# EAGLE design md_ver10.6 (EAGLE 6.4)
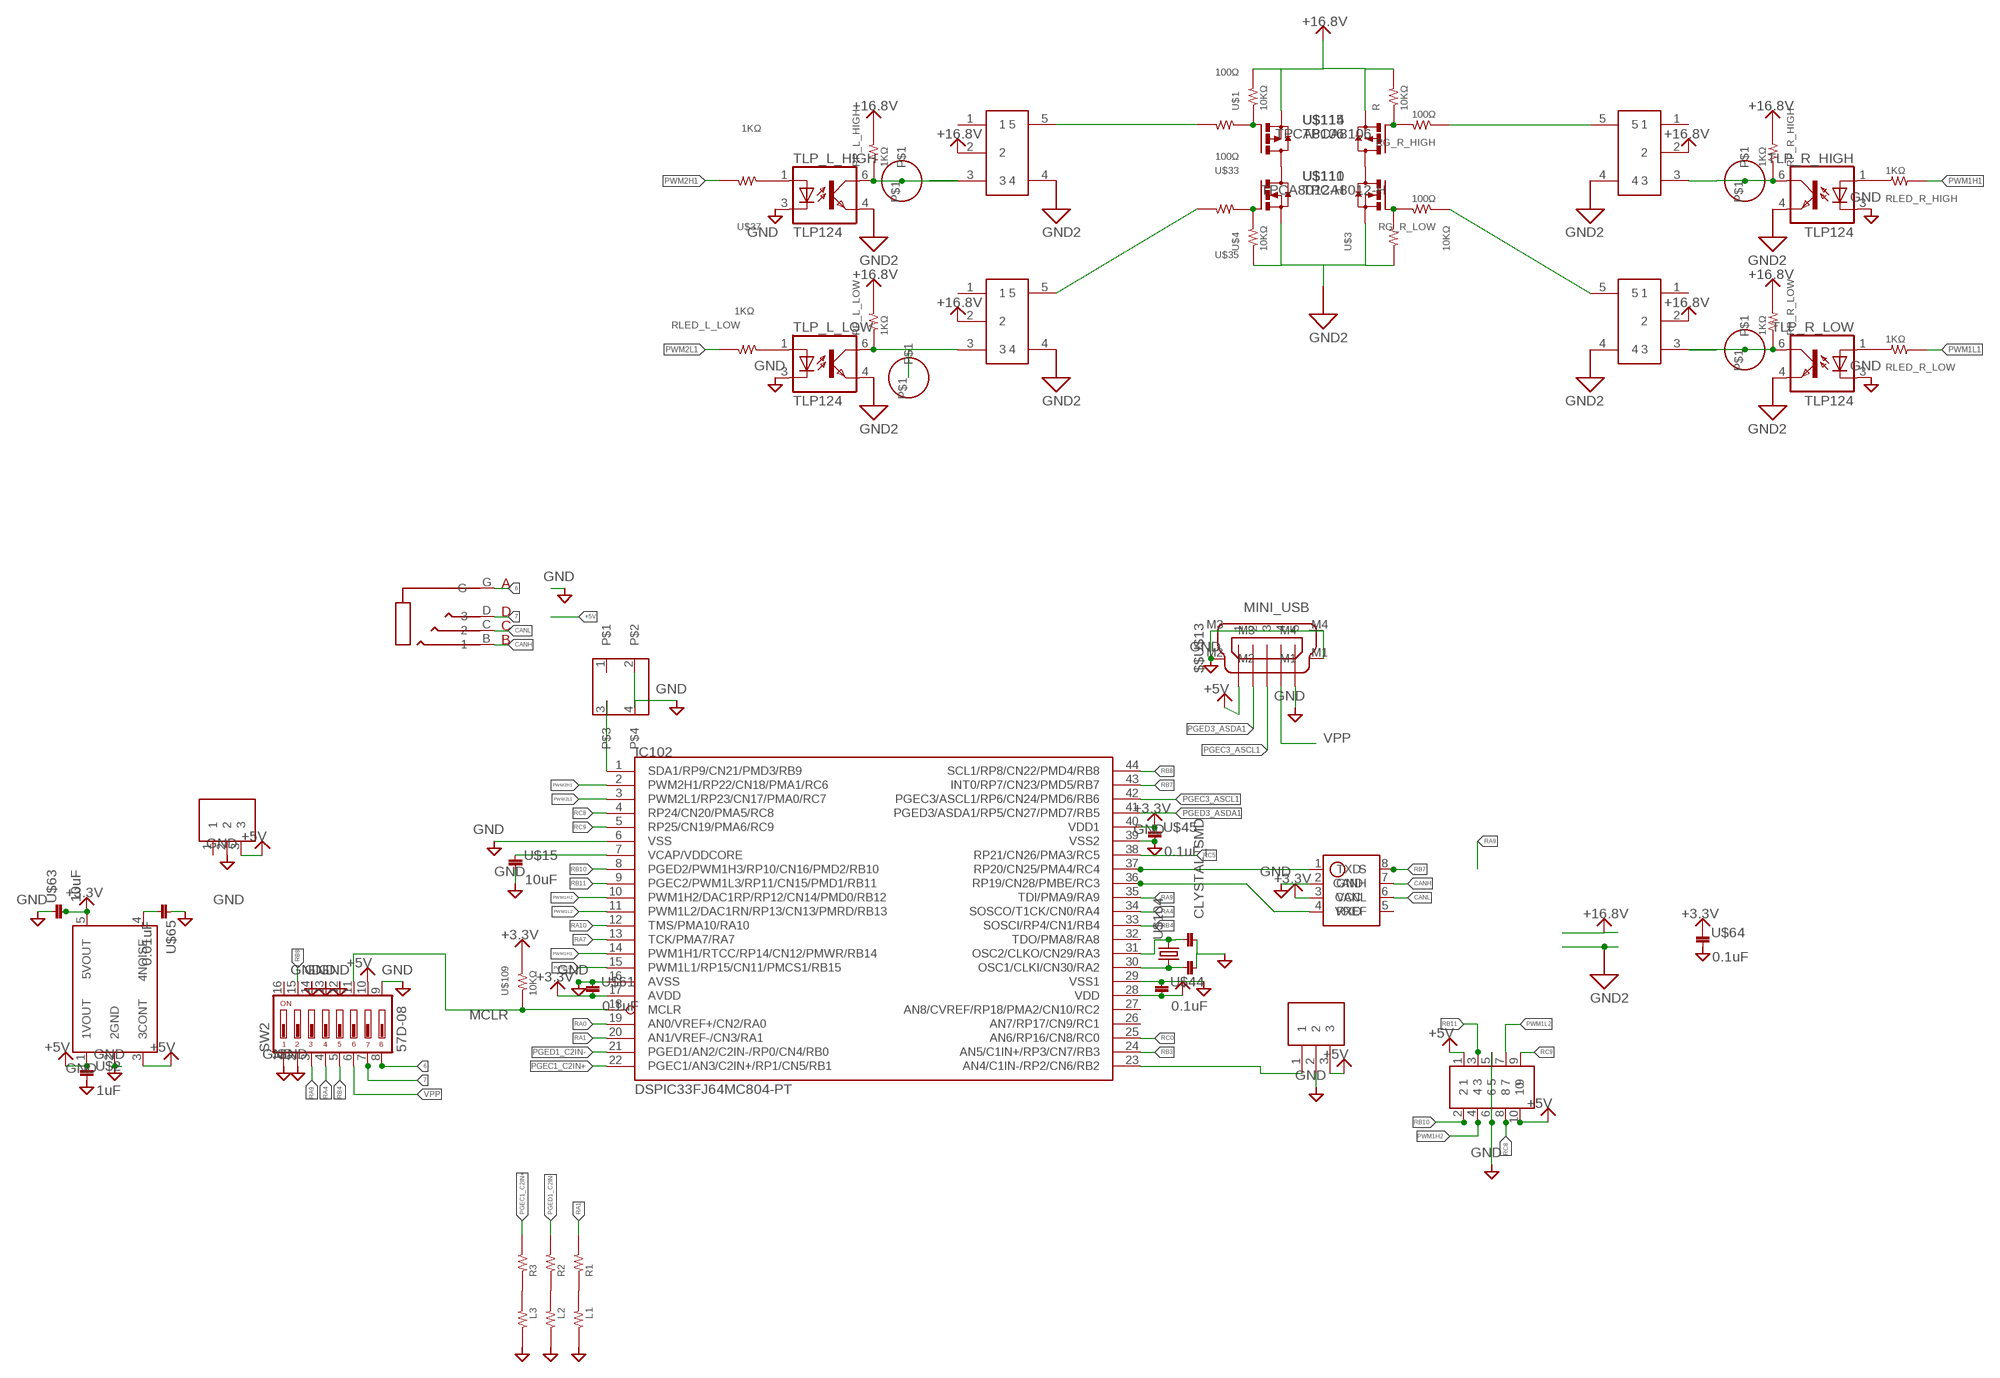
[diagram p0: schematic, sheet 1]

## Parts
$$U$5  PAD1_4MM  [PAD1_4MM]
$$U$6  PAD1_4MM  [PAD1_4MM]
$$U$13  MINI_USB  [MINI_USB]
$$U$14  AUDIO4  [AUDIO4_MJ]
$$U$102  20pF  1608  [1608]
$$U$108  R1  RESISTOR__SMD  [1608]
IC1  Ｒ－７８Ｅ５．０  [Ｒ－７８Ｅ５．０]
IC2  ＰＬ－ＩＲＭ  [ＰＬ－ＩＲＭ]
IC100  SN65HVD1050  [SOIC8]
IC101  TAR5SB  [SSOP5-P-0.95]
IC102  DSPIC33FJ64MC804-PT  [TQFP44]
IC_L_HIGH  MCP1415  [SOT23-5L]
IC_L_LOW  MCP1415  [SOT23-5L]
IC_R_HIGH  MCP1415  [SOT23-5L]
IC_R_LOW  MCP1415  [SOT23-5L]
R  10KΩ  RESISTOR__SMD  [1608]
RG_R_HIGH  100Ω  RESISTOR__SMD  [1608]
RG_R_LOW  100Ω  RESISTOR__SMD  [1608]
RLED_L_LOW  1KΩ  RESISTOR__SMD  [1608]
RLED_R_HIGH  1KΩ  RESISTOR__SMD  [1608]
RLED_R_LOW  1KΩ  RESISTOR__SMD  [1608]
RP_L_HIGH  1KΩ  RESISTOR__SMD  [1608]
RP_L_LOW  1KΩ  RESISTOR__SMD  [1608]
RP_R_HIGH  1KΩ  RESISTOR__SMD  [1608]
RP_R_LOW  1KΩ  RESISTOR__SMD  [1608]
SW1  TACT  [TL1105]
SW2  57D-08  [57D]
TLP_L_HIGH  TLP124  [11−4C1]
TLP_L_LOW  TLP124  [11−4C1]
TLP_R_HIGH  TLP124  [11−4C1]
TLP_R_LOW  TLP124  [11−4C1]
U$1  10KΩ  RESISTOR__SMD  [1608]
U$2  1uF  1608  [1608]
U$3  10KΩ  RESISTOR__SMD  [1608]
U$4  10KΩ  RESISTOR__SMD  [1608]
U$7  PAD1_4MM  [PAD1_4MM]
U$8  PAD1_4MM  [PAD1_4MM]
U$9  PIN_HEADER_52  [PIN_HEADER_5*2]
U$10  L1  RESISTOR__SMD  [1608]
U$11  L2  RESISTOR__SMD  [1608]
U$12  L3  RESISTOR__SMD  [1608]
U$15  10uF  2012  [2012]
U$33  100Ω  RESISTOR__SMD  [1608]
U$35  100Ω  RESISTOR__SMD  [1608]
U$37  1KΩ  RESISTOR__SMD  [1608]
U$44  0.1uF  1608  [1608]
U$45  0.1uF  1608  [1608]
U$61  0.1uF  1608  [1608]
U$63  10uF  2012  [2012]
U$64  0.1uF  1608  [1608]
U$65  0.01uF  1608  [1608]
U$103  20pF  1608  [1608]
U$104  CLYSTAL_SMD  [CRYSTAL_SMD]
U$106  R3  RESISTOR__SMD  [1608]
U$107  R2  RESISTOR__SMD  [1608]
U$109  10KΩ  RESISTOR__SMD  [1608]
U$110  TPCA8012-H  [2-5Q1A]
U$111  TPCA8012-H  [2-5Q1A]
U$114  TPCA8106  [2-5Q1A]
U$115  TPCA8106  [2-5Q1A]

## Nets
6: $$U$14.G SW2.8
7: $$U$14.D SW2.7
+3.3V: IC100.3(VCC) IC101.5(5VOUT) IC102.17(AVDD) IC102.28(VDD) IC102.40(VDD1) U$44.P$2 U$45.P$1 U$61.P$2 U$63.2 U$64.P$1 U$109.2
+5V: $$U$13.1 IC1.3 IC2.3 IC101.1(1VOUT) IC101.3(3CONT) SW2.10 U$2.P$1 U$9.1 U$9.10
+16.8V: IC_L_HIGH.2 IC_L_LOW.2 IC_R_HIGH.2 IC_R_LOW.2 R.2 RP_L_HIGH.2 RP_L_LOW.2 RP_R_HIGH.2 RP_R_LOW.2 U$1.2 U$114.1(S) U$114.2(S) U$114.3(S) U$115.1(S) U$115.2(S) U$115.3(S)
CANH: $$U$14.B IC100.7(CANH)
CANL: $$U$14.C IC100.6(CANL)
GND: $$U$13.5 $$U$13.M1 $$U$13.M2 $$U$13.M3 $$U$13.M4 $$U$102.P$2 IC1.2 IC2.2 IC100.2(GND) IC101.2(2GND) IC102.6(VSS) IC102.16(AVSS) IC102.29(VSS1) IC102.39(VSS2) SW1.2 SW1.4 SW2.1 SW2.2 SW2.9 SW2.12 SW2.13 SW2.14 TLP_L_HIGH.3(C) TLP_L_LOW.3(C) TLP_R_HIGH.3(C) TLP_R_LOW.3(C) U$2.P$2 U$9.5 U$9.6 U$10.1 U$11.1 U$12.1 U$15.2 U$44.P$1 U$45.P$2 U$61.P$1 U$63.1 U$64.P$2 U$65.P$1 U$103.P$2
GND2: IC_L_HIGH.4 IC_L_LOW.4 IC_R_HIGH.4 IC_R_LOW.4 TLP_L_HIGH.4(EMIT) TLP_L_LOW.4(EMIT) TLP_R_HIGH.4(EMIT) TLP_R_LOW.4(EMIT) U$3.1 U$4.1 U$110.1(S) U$110.2(S) U$110.3(S) U$111.1(S) U$111.2(S) U$111.3(S)
M1: U$111.5(D) U$111.6(D) U$111.7(D) U$111.8(D) U$115.5(D) U$115.6(D) U$115.7(D) U$115.8(D)
M2: U$110.5(D) U$110.6(D) U$110.7(D) U$110.8(D) U$114.5(D) U$114.6(D) U$114.7(D) U$114.8(D)
MCLR: IC102.18(MCLR) SW2.11 U$109.1
N$1: U$4.2 U$35.1 U$111.4(G)
N$2: IC101.4(4NOISE) U$65.P$2
N$3: RLED_L_LOW.1 TLP_L_LOW.1(A)
N$4: RG_R_LOW.2 U$3.2 U$110.4(G)
N$5: IC_L_HIGH.5 U$33.2
N$6: $$U$6.P$1 IC_L_LOW.3 RP_L_LOW.1 TLP_L_LOW.6(COL)
N$7: IC_R_LOW.5 RG_R_LOW.1
N$9: RLED_R_LOW.1 TLP_R_LOW.1(A)
N$10: TLP_L_HIGH.1(A) U$37.1
N$11: $$U$5.P$1 IC_L_HIGH.3 RP_L_HIGH.1 TLP_L_HIGH.6(COL)
N$14: IC_L_LOW.5 U$35.2
N$15: IC_R_HIGH.3 RP_R_HIGH.1 TLP_R_HIGH.6(COL) U$8.P$1
N$16: RLED_R_HIGH.1 TLP_R_HIGH.1(A)
N$17: IC2.1 IC102.23(AN4/C1IN-/RP2/CN6/RB2)
N$18: IC_R_HIGH.5 RG_R_HIGH.1
N$19: U$1.1 U$33.1 U$115.4(G)
N$20: R.1 RG_R_HIGH.2 U$114.4(G)
N$21: U$12.2 U$106.1
N$22: $$U$102.P$1 IC102.30(OSC1/CLKI/CN30/RA2) U$104.1
N$23: IC102.31(OSC2/CLKO/CN29/RA3) U$103.P$1 U$104.2
N$24: U$11.2 U$107.1
N$25: $$U$108.1 U$10.2
N$26: IC102.1(SDA1/RP9/CN21/PMD3/RB9) SW1.3
N$27: IC100.1(TXD) IC102.37(RP20/CN25/PMA4/RC4)
N$30: IC100.4(RXD) IC102.36(RP19/CN28/PMBE/RC3)
PGEC1_C2IN+: IC102.22(PGEC1/AN3/C2IN+/RP1/CN5/RB1) U$106.2
PGEC3_ASCL1: $$U$13.3 IC102.42(PGEC3/ASCL1/RP6/CN24/PMD6/RB6)
PGED1_C2IN-: IC102.21(PGED1/AN2/C2IN-/RP0/CN4/RB0) U$107.2
PGED3_ASDA1: $$U$13.2 IC102.41(PGED3/ASDA1/RP5/CN27/PMD7/RB5)
PWM1H1: IC102.14(PWM1H1/RTCC/RP14/CN12/PMWR/RB14) RLED_R_HIGH.2
PWM1H2: IC102.10(PWM1H2/DAC1RP/RP12/CN14/PMD0/RB12) U$9.4
PWM1L1: IC102.15(PWM1L1/RP15/CN11/PMCS1/RB15) RLED_R_LOW.2
PWM1L2: IC102.11(PWM1L2/DAC1RN/RP13/CN13/PMRD/RB13) U$9.7
PWM2H1: IC102.2(PWM2H1/RP22/CN18/PMA1/RC6) U$37.2
PWM2L1: IC102.3(PWM2L1/RP23/CN17/PMA0/RC7) RLED_L_LOW.2
RA0: IC102.19(AN0/VREF+/CN2/RA0)
RA1: $$U$108.2 IC102.20(AN1/VREF-/CN3/RA1)
RA4: IC102.34(SOSCO/T1CK/CN0/RA4) SW2.4
RA7: IC102.13(TCK/PMA7/RA7)
RA9: IC102.35(TDI/PMA9/RA9) SW2.3
RA10: IC102.12(TMS/PMA10/RA10)
RB3: IC102.24(AN5/C1IN+/RP3/CN7/RB3)
RB4: IC102.33(SOSCI/RP4/CN1/RB4) SW2.5
RB7: IC100.8(S) IC102.43(INT0/RP7/CN23/PMD5/RB7)
RB8: IC102.44(SCL1/RP8/CN22/PMD4/RB8) SW2.15
RB10: IC102.8(PGED2/PWM1H3/RP10/CN16/PMD2/RB10) U$9.2
RB11: IC102.9(PGEC2/PWM1L3/RP11/CN15/PMD1/RB11) U$9.3
RC0: IC102.25(AN6/RP16/CN8/RC0)
RC5: IC102.38(RP21/CN26/PMA3/RC5)
RC8: IC102.4(RP24/CN20/PMA5/RC8) U$9.8
RC9: IC102.5(RP25/CN19/PMA6/RC9) U$9.9
TLP_R_LOW: IC_R_LOW.3 RP_R_LOW.1 TLP_R_LOW.6(COL) U$7.P$1
VCAP/VDDCORE: IC102.7(VCAP/VDDCORE) U$15.1
VPP: $$U$13.4 SW2.6
Unconnected: IC1.1 IC100.5(VREF) IC102.26(AN7/RP17/CN9/RC1) IC102.27(AN8/CVREF/RP18/PMA2/CN10/RC2) IC102.32(TDO/PMA8/RA8) IC_L_HIGH.1 IC_L_LOW.1 IC_R_HIGH.1 IC_R_LOW.1 SW1.1 SW2.16

## Library data of the parts
$$U$5 $$U$6 U$7 U$8 = 08_CONECTOR:PAD1_4MM
$$U$13 = 08_CONECTOR:MINI_USB
$$U$14 = 08_CONECTOR:AUDIO4
$$U$102 U$2 U$44 U$45 U$61 U$64 U$65 U$103 = 02_C:1608
$$U$108 R RG_R_HIGH RG_R_LOW RLED_L_LOW RLED_R_HIGH RLED_R_LOW RP_L_HIGH RP_L_LOW RP_R_HIGH RP_R_LOW U$1 U$3 U$4 U$10-U$12 U$33 U$35 U$37 U$106 U$107 U$109 = 01_R:RESISTOR__SMD
IC1 = 04_IC:Ｒ－７８Ｅ５．０
IC2 = 04_IC:ＰＬ－ＩＲＭ
IC100 = 04_IC:SN65HVD1050
IC101 = 04_IC:TAR5SB
IC102 = microchip-dspic33fjxxmc:DSPIC33FJ64MC804: dsPIC33FJ32MC302/304, dsPIC33FJ64MCX02/X04, AND dsPIC33FJ128MCX02/X04 High-Performance, 16-bit Digital Signal Controllers Package:44 Pin TQFP Operating Range: * Up to 40 MIPS operation (at 3.0V -3.6V): - Industrial temperature range (-40°C to +85°C) - Extended temperature range (-40°C to +125°C) High-Performance DSC CPU: * Modified Harvard architecture * C compiler optimized instruction set * 16-bit wide data path * 24-bit wide instructions * Linear program memory addressing up to 4M instruction words * Linear data memory addressing up to 64 Kbytes * 83 base instructions: mostly 1 word/1 cycle * Two 40-bit accumulators with rounding and saturation options * Flexible and powerful addressing modes: - Indirect - Modulo - Bit-Reversed * Software stack * 16 x 16 fractional/integer multiply operations * 32/16 and 16/16 divide operations * Single-cycle multiply and accumulate: - Accumulator write back for DSP operations - Dual data fetch * Up to ±16-bit shifts for up to 40-bit data Direct Memory Access (DMA): * 8-channel hardware DMA * Up to 2 Kbytes dual ported DMA buffer area (DMA RAM) to store data transferred via DMA: - Allows data transfer between RAM and a peripheral while CPU is executing code (no cycle stealing) * Most peripherals support DMA Timers/Capture/Compare/PWM: * Timer/Counters, up to five 16-bit timers: - Can pair up to make two 32-bit timers - One timer runs as a Real-Time Clock with an external 32.768 kHz oscillator - Programmable prescaler * Input Capture (up to four channels): - Capture on up, down or both edges - 16-bit capture input functions - 4-deep FIFO on each capture * Output Compare (up to four channels): - Single or Dual 16-bit Compare mode - 16-bit Glitchless PWM mode * Hardware Real-Time Clock/Calendar (RTCC): - Provides clock, calendar, and alarm functions Interrupt Controller: * 5-cycle latency * Up to 53 available interrupt sources * Up to three external interrupts * Seven programmable priority levels * Five processor exceptions Digital I/O: * Peripheral pin Select functionality * Up to 35 programmable digital I/O pins * Wake-up/Interrupt-on-Change for up to 31 pins * Output pins can drive from 3.0V to 3.6V * Up to 5V output with open drain configuration * All digital input pins are 5V tolerant * 4 mA sink on all I/O pins On-Chip Flash and SRAM: * Flash program memory (up to 128 Kbytes) * Data SRAM (up to 16 Kbytes) * Boot, Secure, and General Security for program Flash System Management: * Flexible clock options: - External, crystal, resonator, internal RC - Fully integrated Phase-Locked Loop (PLL) - Extremely low jitter PLL * Power-up Timer * Oscillator Start-up Timer/Stabilizer * Watchdog Timer with its own RC oscillator * Fail-Safe Clock Monitor * Reset by multiple sources Power Management: * On-chip 2.5V voltage regulator * Switch between clock sources in real time * Idle, Sleep, and Doze modes with fast wake-up Analog-to-Digital Converters (ADCs): * 10-bit, 1.1 Msps or 12-bit, 500 Ksps conversion: - Two and four simultaneous samples (10-bit ADC) - Up to nine input channels with auto-scanning - Conversion start can be manual or synchronized with one of four trigger sources - Conversion possible in Sleep mode - ±2 LSb max integral nonlinearity - ±1 LSb max differential nonlinearity Audio Digital-to-Analog Converter (DAC): - 16-bit Dual Channel DAC module - 100 Ksps maximum sampling rate - Second-Order Digital Delta-Sigma Modulator Comparator Module: * Two analog comparators with programmable input/output configuration CMOS Flash Technology: * Low-power, high-speed Flash technology * Fully static design * 3.3V (±10%) operating voltage * Industrial and Extended temperature * Low power consumption Motor Control Peripherals: * 6-channel 16-bit Motor Control PWM: - Three duty cycle generators - Independent or Complementary mode - Programmable dead-time and output polarity - Edge-aligned or center-aligned - Manual output override control - One Fault input - Trigger for ADC conversions - PWM frequency for 16-bit resolution (@ 40 MIPS) = 1220 Hz for Edge-Aligned mode, 610 Hz for Center-Aligned mode - PWM frequency for 11-bit resolution (@ 40 MIPS) = 39.1 kHz for Edge-Aligned mode, 19.55 kHz for Center-Aligned mode * 2-channel 16-bit Motor Control PWM: - One duty cycle generator - Independent or Complementary mode - Programmable dead time and output polarity - Edge-aligned or center-aligned - Manual output override control - One Fault input - Trigger for ADC conversions - PWM frequency for 16-bit resolution (@ 40 MIPS) = 1220 Hz for Edge-Aligned mode, 610 Hz for Center-Aligned mode - PWM frequency for 11-bit resolution (@ 40 MIPS) = 39.1 kHz for Edge-Aligned mode, 19.55 kHz for Center-Aligned mode * 2-Quadrature Encoder Interface module: - Phase A, Phase B, and index pulse input - 16-bit up/down position counter - Count direction status - Position Measurement (x2 and x4) mode - Programmable digital noise filters on inputs - Alternate 16-bit Timer/Counter mode - Interrupt on position counter rollover/underflow
IC_L_HIGH IC_L_LOW IC_R_HIGH IC_R_LOW = 04_IC:MCP1415
SW1 = switch:TACT
SW2 = switch:57D-08
TLP_L_HIGH TLP_L_LOW TLP_R_HIGH TLP_R_LOW = 04_IC:TLP124
U$9 = 08_CONECTOR:PIN_HEADER_5*2
U$15 U$63 = 02_C:2012
U$104 = CRYSTAL:CLYSTAL_SMD
U$110 U$111 = 06_FET:TPCA8012-H
U$114 U$115 = 06_FET:TPCA8106

## Net classes
0 default: clearance 0.2 mm

## Board
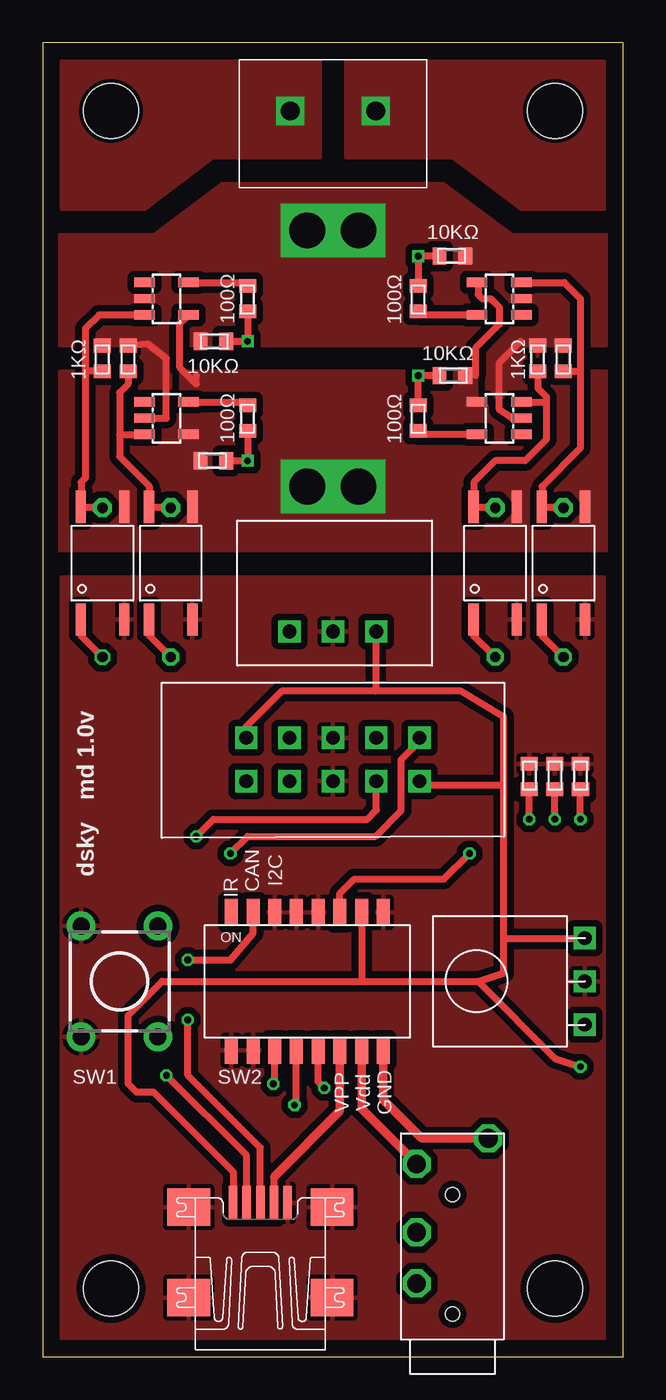
[diagram p1: board, top side]
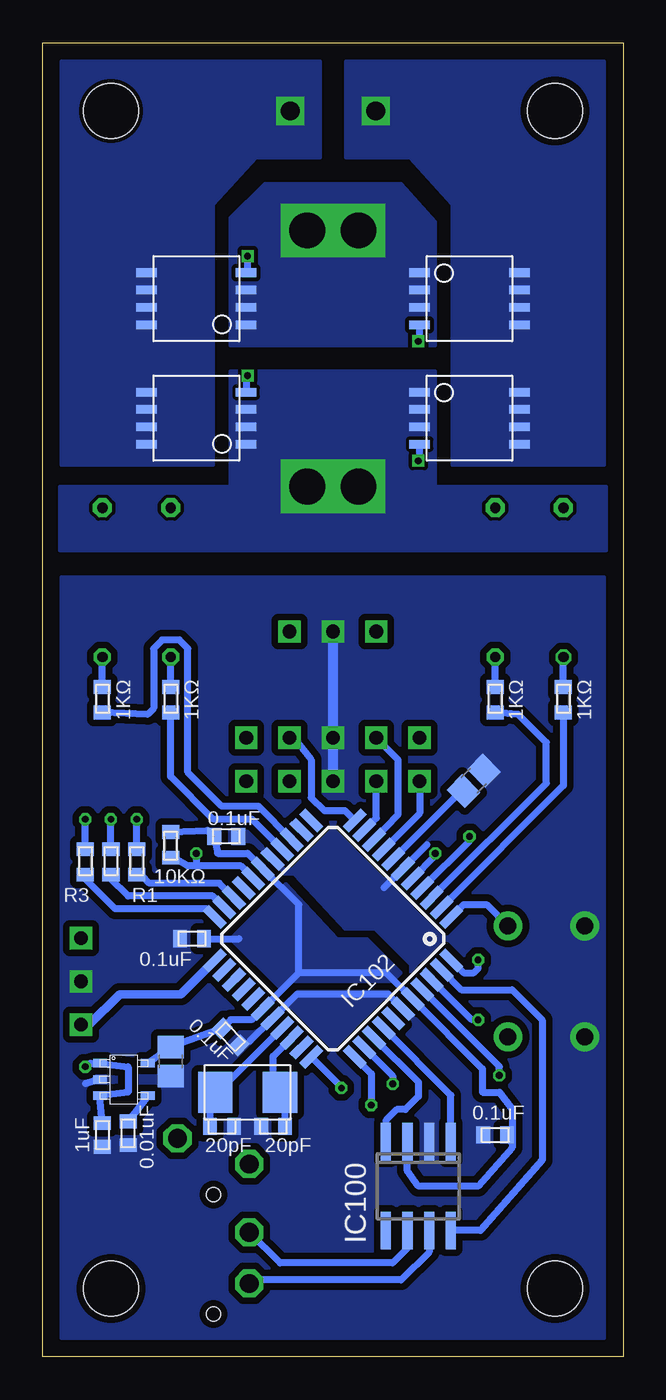
[diagram p2: board, bottom side, seen from below]

Size 34 x 77 mm. Coordinates in mm from the lower left corner, seen from the top.
Outline: 0,0 34,0 34,77 0,77 0,0
Copper layers (1*16): Top 0.035mm / dielectric 1.5mm / Bottom 0.035mm
Design rules "Fusion_eagle_rule_v1.1": minimum track width 6mil, minimum drill 12mil, track to track 6mil, track to pad 6mil, pad to pad 6mil, via to via 6mil, smd to smd 0mil, copper to edge 10mil, drill to drill 10mil, minimum pad ring 10mil, minimum via ring 6mil, stop-mask expansion 2mil, vias tented up to drill 100mil, thermal gap 10mil
Holes 3.2 mm at 4,4 30,4 4,73 30,73

### Footprints (pad centres in the part's own frame; a part is rotated, then mirrored left to right if it is on the bottom)
PAD1_4MM = drill 0.6 pad 1 octagon: P$1 0,0
MINI_USB = smd 2 x 0.5: 1 3.52,1.6; 2 3.52,0.8; 3 3.52,0; 4 3.52,-0.8; 5 3.52,-1.6 | smd 2.2 x 2.5: M1 -2.03,-4.2; M2 -2.03,4.2; M3 3.27,4.2; M4 3.27,-4.2
AUDIO4_MJ = drill 1.1 octagon: B 3.3,2.1; C 6.3,2.1; D 10.3,2.1; G 11.8,-2.1 | hole 0.8: 1.5,0; 8.5,0
1608 = smd 0.8 x 1: P$1 -0.7,0; P$2 0.7,0
1608' = smd 0.8 x 1: 1 -0.75,0; 2 0.75,0
Ｒ－７８Ｅ５．０ = drill 0.8 square: 1 -2.54,0; 2 0,0; 3 2.54,0
ＰＬ－ＩＲＭ = drill 0.8 square: 1 -2.54,0; 2 0,0; 3 2.54,0
SOIC8 = smd 0.6 x 2.2: 1 -1.905,-2.6; 2 -0.635,-2.6; 3 0.635,-2.6; 4 1.905,-2.6; 5 1.905,2.6; 6 0.635,2.6; 7 -0.635,2.6; 8 -1.905,2.6
SSOP5-P-0.95 = smd 0.5 x 0.8: 1 -0.95,-1.4; 2 0,-1.4; 3 0.95,-1.4; 4 0.95,1.4; 5 -0.95,1.4
TQFP44 = smd 1.5 x 0.5: 1 -5.8,4; 2 -5.8,3.2; 3 -5.8,2.4; 4 -5.8,1.6; 5 -5.8,0.8; 6 -5.8,0; 7 -5.8,-0.8; 8 -5.8,-1.6; 9 -5.8,-2.4; 10 -5.8,-3.2; 11 -5.8,-4; 23 5.8,-4; 24 5.8,-3.2; 25 5.8,-2.4; 26 5.8,-1.6; 27 5.8,-0.8; 28 5.8,0; 29 5.8,0.8; 30 5.8,1.6; 31 5.8,2.4; 32 5.8,3.2; 33 5.8,4 | smd 0.5 x 1.5: 12 -4,-5.8; 13 -3.2,-5.8; 14 -2.4,-5.8; 15 -1.6,-5.8; 16 -0.8,-5.8; 17 0,-5.8; 18 0.8,-5.8; 19 1.6,-5.8; 20 2.4,-5.8; 21 3.2,-5.8; 22 4,-5.8; 34 4,5.8; 35 3.2,5.8; 36 2.4,5.8; 37 1.6,5.8; 38 0.8,5.8; 39 0,5.8; 40 -0.8,5.8; 41 -1.6,5.8; 42 -2.4,5.8; 43 -3.2,5.8; 44 -4,5.8
SOT23-5L = smd 0.55 x 1.2: 1 -0.95,-1.3; 2 0,-1.3; 3 0.95,-1.3; 4 0.95,1.3; 5 -0.95,1.3
TL1105 = drill 1 pad 1.676: 1 -2.25,3.25; 2 2.25,3.25; 3 -2.25,-3.25; 4 2.25,-3.25
57D = smd 0.76 x 1.58: 1 -4.445,-4.045; 2 -3.175,-4.045; 3 -1.905,-4.045; 4 -0.635,-4.045; 5 0.635,-4.045; 6 1.905,-4.045; 7 3.175,-4.045; 8 4.445,-4.045; 9 4.445,4.045; 10 3.175,4.045; 11 1.905,4.045; 12 0.635,4.045; 13 -0.635,4.045; 14 -1.905,4.045; 15 -3.175,4.045; 16 -4.445,4.045
11−4C1 = smd 0.6 x 1.9: 1 -1.27,-3.3; 3 1.27,-3.3; 4 1.27,3.3; 6 -1.27,3.3
PIN_HEADER_5*2 = drill 0.8 square: 1 -5.08,1.27; 2 -5.08,-1.27; 3 -2.54,1.27; 4 -2.54,-1.27; 5 0,1.27; 6 0,-1.27; 7 2.54,1.27; 8 2.54,-1.27; 9 5.08,1.27; 10 5.08,-1.27
2012 = smd 1.3 x 1.5: 1 -0.85,0; 2 0.85,0
CRYSTAL_SMD = smd 2 x 2.4: 1 -1.9,0; 2 1.9,0
2-5Q1A = smd 0.5 x 1.2: 1 -1.524,-2.921; 2 -0.508,-2.921; 3 0.508,-2.921; 4 1.524,-2.921; 5 1.524,2.921; 6 0.508,2.921; 7 -0.508,2.921; 8 -1.524,2.921

### Placement (x,y rotation side)
$$U$5  3.5,49.75 0 top
$$U$6  7.5,49.75 0 top
$$U$13  12.75,5.5 90 top
$$U$14  24,1 90 top
$$U$102  23.5,13.5 0 bottom
$$U$108  R1  [1608']  28.5,29 270 bottom
IC1  17,42.5 0 top
IC2  31.75,22 90 top
IC100  12,10 180 bottom
IC101  29.25,16.25 270 bottom
IC102  17,24.5 225 bottom
IC_L_HIGH  7.25,62 270 top
IC_L_LOW  7.25,55 270 top
IC_R_HIGH  26.75,62 90 top
IC_R_LOW  26.75,55 90 top
R  10KΩ  [1608']  24,64.5 0 top
RG_R_HIGH  100Ω  [1608']  22,62 90 top
RG_R_LOW  100Ω  [1608']  22,55 90 top
RLED_L_LOW  1KΩ  [1608']  7.5,38.5 270 bottom
RLED_R_HIGH  1KΩ  [1608']  30.5,38.5 270 bottom
RLED_R_LOW  1KΩ  [1608']  26.5,38.5 270 bottom
RP_L_HIGH  1KΩ  [1608']  3.5,58.5 90 top
RP_L_LOW  1KΩ  [1608']  5,58.5 90 top
RP_R_HIGH  1KΩ  [1608']  30.5,58.5 90 top
RP_R_LOW  1KΩ  [1608']  29,58.5 90 top
SW1  4.5,22 180 top
SW2  15.5,22 0 top
TLP_L_HIGH  3.5,46.5 0 top
TLP_L_LOW  7.5,46.5 0 top
TLP_R_HIGH  30.5,46.5 0 top
TLP_R_LOW  26.5,46.5 0 top
U$1  10KΩ  [1608']  10,59.5 180 top
U$2  30.5,13 270 bottom
U$3  10KΩ  [1608']  24,57.5 180 top
U$4  10KΩ  [1608']  10,52.5 0 top
U$7  26.5,49.75 0 top
U$8  30.5,49.75 0 top
U$9  17,35 0 top
U$10  L1  [1608']  28.5,34 270 top
U$11  L2  [1608']  30,34 270 top
U$12  L3  [1608']  31.5,34 270 top
U$15  8.75,33.75 45 bottom
U$33  100Ω  [1608']  12,62 90 top
U$35  100Ω  [1608']  12,55 90 top
U$37  1KΩ  [1608']  3.5,38.5 270 bottom
U$44  23,18.75 135 bottom
U$45  7.5,13 180 bottom
U$61  23.25,30.5 180 bottom
U$63  26.5,17.3 90 bottom
U$64  25.25,24.5 180 bottom
U$65  29,13.1 90 bottom
U$103  20.5,13.5 180 bottom
U$104  22,15.5 0 bottom
U$106  R3  [1608']  31.5,29 270 bottom
U$107  R2  [1608']  30,29 270 bottom
U$109  10KΩ  [1608']  26.5,30 90 bottom
U$110  25,55 90 bottom
U$111  9,55 270 bottom
U$114  25,62 90 bottom
U$115  9,62 270 bottom

### Tracks (layer width: path | path; a pad name or v marks a point on that pad's centre or on a via)
6
  Top 0.5: $$U$14.G 22.2,12.8 19.95,15.05 SW2.8
7
  Top 0.5: $$U$14.D 18.68,14.53 SW2.7
+3.3V  (1 unrouted)
  Bottom 0.4: IC102.40 13.87,22.5 19,22.5 | 19,22.5 IC102.28 21.75,19.75 23,19.75 U$44.P$2 U$63.2 IC101.5 | 19,22.5 19,26.5 IC102.17 22,29.5 | 22,29.5 23.75,29.5 23.95,30.45 U$61.P$2 | 22,29.5 | U$45.P$1 6.8,12.8 6.5,12.5 | U$64.P$1 22.5,24.5
  Bottom 0.406: U$109.2 24.35,30.85 24,30.5 | IC102.40 8.25,16.88 8.25,15.5 7.25,15.5 6.5,14.5 6.5,12.5 6.5,12.25 8.5,10 12,10 12.63,10.88 IC100.3
  pour Bottom: 13.5,22 13,22.5 15,24.5 16.75,24.5 19.75,27.75 23,24.5 20,21.5 19.5,22
+5V  (via drill 0.4)
  Top 0.4: $$U$13.1 11.15,10.85 6.5,15.5 5.5,15.5 5,16 5,20 7,22 18.68,22 | 18.68,22 25.5,22 | 25.5,22 27,22.5 27,24.5 | 27,24.5 27,33.5 | 27,33.5 27,37.5 24.5,39 19.5,39 | 19.5,39 14,39 11.92,36.92 U$9.1 | IC1.3 19.5,42.46 19.5,39 | U$9.10 22.31,33.5 27,33.5 | IC2.3 31.71,24.5 27,24.5 | 25.5,22 30,17.5 v31.5,17 | SW2.10 18.68,22
  Bottom 0.4: U$2.P$1 IC101.3 29,15.5 29,17 IC101.1 31.2,17.2 v31.5,17
+16.8V  (via drill 2.1)
  Top 0.4: IC_L_LOW.2 7.25,55 7.25,58.5 6.15,59.35 RP_L_LOW.2 | IC_R_LOW.2 27.5,55 26.75,55.5 26.75,58.25 28,59.5
  other vias: 18.5,66 15.5,66
  pour Bottom (isolate 0.254, rank 2, no thermals): 13,68.75 21,68.75 23,66.75 23,59.25 11,59.25 11,66.5
  pour Top (isolate 0.4, rank 2, no thermals): 1,59.25 33,59.25 33,65.75 27.5,65.75 23.5,68.75 10.5,68.75 6.5,65.75 1,65.75
  pour Top (isolate 0.4): 5.25,59.25 5.25,56.75 7.5,56.75 7.5,59.25
  pour Top (isolate 0.4): 26,59.25 26,56.25 29,56.25 29,59.25
CANH
  Bottom 0.4: IC100.7 11.37,6.13 13,4.5 21.7,4.5 $$U$14.B
CANL
  Bottom 0.4: IC100.6 12.63,6.37 13.5,5.5 20.1,5.5 $$U$14.C
GND
  Bottom 0.4: 11.5,30 IC102.6 14,27.5 | 21.86,18.5 IC102.29 19.12,21.25 13.75,21.25 IC102.39 | IC101.2 31.5,16
  Bottom 0.6: IC1.2 U$9.5 U$9.6
  pour Top (isolate 0.4): 1.1,45.7 32.9,45.7 32.9,1.1 1.1,1.1
  pour Bottom (isolate 0.4, rank 2, no thermals): 1.1,45.7 32.9,45.7 32.9,1.1 1.1,1.1
GND2  (via drill 2.1)
  Top 0.4: IC_L_HIGH.4 8,60.5 8,58 9,57 9,57.5 | 25.5,62.9 25.5,62.25 25.75,62 26.25,62 26.75,61.5 26.75,60.5 25.35,59.1 25.35,57.5
  Top 0.5: IC_R_HIGH.4 25.5,62.9
  other vias: 18.5,51 15.5,51
  pour Bottom (isolate 0.1, no thermals): 33,47.25 1,47.25 1,51 11,51 11,57.75 23,57.75 23,51 33,51
  pour Top (isolate 0.4, rank 2, no thermals): 1,57.75 33,57.75 33,47.25 1,47.25
M1  (via drill 1.1)
  other vias: 14.5,73
  pour Bottom (isolate 0.406, no thermals): 1.1,75.9 16.25,75.9 16.25,70.25 12.5,70.25 10,67.5 10,52.25 1.1,52.25
  pour Top (no thermals): 1.1,75.9 16.25,75.9 16.25,70.25 10,70.25 6,67.25 1.1,67.25
M2  (via drill 1.1)
  other vias: 19.5,73
  pour Bottom (isolate 0.254, no thermals): 24,52.25 24,67.5 21.5,70.25 17.75,70.25 17.75,75.9 32.9,75.9 32.9,52.25
  pour Top (no thermals): 17.75,75.9 32.9,75.9 32.9,67.25 28,67.25 24,70.25 17.75,70.25
MCLR  (via drill 0.4)
  Top 0.4: SW2.11 17.41,27.16 18.25,28 23.5,28 v25,29.5
  Bottom 0.4: IC102.18 22.38,28.75 25,28.75 | 25,28.75 25.5,28.75 26.15,29.15 U$109.1 | v25,29.5 25,28.75
N$1  (via drill 0.4)
  Top 0.4: U$35.1 v12,52.5
  Top 0.406: U$4.2 v12,52.5
  Bottom 0.406: v12,52.5 11.92,52.58 U$111.4
N$2
  Bottom 0.4: IC101.4 U$65.P$2
N$3  (via drill 0.6 pad 1)
  Top 0.406: v7.5,41 6.23,42.27 TLP_L_LOW.1
  Bottom 0.406: RLED_L_LOW.1 v7.5,41
N$4  (via drill 0.4)
  Top 0.4: U$3.2 v22,57.5
  Top 0.406: RG_R_LOW.2 v22,57.5
  Bottom 0.406: v22,57.5 22.08,57.42 U$110.4
N$5
  Top 0.4: IC_L_HIGH.5 11.9,62.95 11.9,62.85 U$33.2
N$6
  Top 0.4: $$U$6.P$1 6.28,49.75 TLP_L_LOW.6 6.23,51.02 4.5,52.75 4.5,54 | RP_L_LOW.1 5,57 4.5,56.5 4.5,54 | IC_L_LOW.3 5.9,54 4.5,54
N$7
  Top 0.406: IC_R_LOW.5 22,54.05 RG_R_LOW.1
N$9  (via drill 0.6 pad 1)
  Top 0.406: v26.5,41 25.23,42.27 TLP_R_LOW.1
  Bottom 0.406: RLED_R_LOW.1 v26.5,41
N$10  (via drill 0.6)
  Top 0.4: v3.5,41 2.23,42.27 TLP_L_HIGH.1
  Bottom 0.4: U$37.1 v3.5,41
N$11
  Top 0.4: $$U$5.P$1 2.28,49.75 TLP_L_HIGH.6 2.25,49.82 2.25,51.25 2.5,51.5 2.5,57.75 | IC_L_HIGH.3 3.3,61.05 2.5,60.25 2.5,57.75 | RP_L_HIGH.1 2.5,57.75
N$14
  Top 0.4: IC_L_LOW.5 11.8,55.95 U$35.2
N$15
  Top 0.4: U$8.P$1 29.28,49.75 TLP_R_HIGH.6 29.25,49.82 29.25,51 31.5,53.25 31.5,57.75 | IC_R_HIGH.3 30.55,62.95 31.5,62 31.5,57.75 | RP_R_HIGH.1 31.5,57.75
N$16  (via drill 0.6 pad 1)
  Top 0.406: v30.5,41 29.23,42.27 TLP_R_HIGH.1
  Bottom 0.406: RLED_R_HIGH.1 v30.5,41
N$17
  Bottom 0.5: IC102.23 25.91,21.25 29.5,21.25 31.29,19.46 IC2.1
N$18
  Top 0.406: IC_R_HIGH.5 22.1,61.05 RG_R_HIGH.1
N$19  (via drill 0.4)
  Top 0.4: U$33.1 v12,59.5
  Top 0.406: U$1.1 v12,59.5
  Bottom 0.406: 12,60.48 U$115.4 11.92,59.67 v12,59.5
N$20  (via drill 0.4)
  Top 0.406: RG_R_HIGH.2 v22,64.5 R.1
  Bottom 0.406: U$114.4 22,63.6 v22,64.5
N$21  (via drill 0.4)
  Top 0.406: v31.5,31.5 U$12.2
  Bottom 0.4: U$106.1 v31.5,31.5
N$22
  Bottom 0.4: IC102.30 23.74,15.5 23.74,15 U$104.1 24.2,15.2 $$U$102.P$1
N$23
  Bottom 0.4: IC102.31 20.5,17.61 20.5,15.9 U$104.2 19.8,15.2 U$103.P$1
N$24  (via drill 0.4)
  Top 0.4: v30,31.5 U$11.2
  Bottom 0.4: U$107.1 v30,31.5
N$25  (via drill 0.4)
  Top 0.4: v28.5,31.5 U$10.2
  Bottom 0.4: $$U$108.1 v28.5,31.5
N$26
  Bottom 0.4: IC102.1 9.34,26.5 8,26.5 SW1.3
N$27
  Bottom 0.4: IC100.1 10.1,15.33 IC102.37
N$30
  Bottom 0.4: IC102.36 12,16.11 12,15.25 12.75,14.5 13.25,14.5 13.9,13.85 IC100.4
PGEC1_C2IN+
  Bottom 0.4: IC102.22 24.41,26.25 29.75,26.25 31.5,28 U$106.2
PGEC3_ASCL1  (via drill 0.4)
  Top 0.4: $$U$13.3 12.75,12.25 8.5,16.5 v8.5,19.75
  Bottom 0.4: v8.5,19.75 8.86,19.75 IC102.42
PGED1_C2IN-
  Bottom 0.4: IC102.21 24.02,27 29,27 30,28 U$107.2
PGED3_ASDA1  (via drill 0.4)
  Top 0.4: $$U$13.2 11.95,11.8 v7.25,16.5
  Bottom 0.4: v7.25,16.5 7.25,17.01 IC102.41
PWM1H1
  Bottom 0.4: IC102.14 21.36,32.25 23.5,32.25 25.5,34.25 25.5,41.5 26,42 27,42 27.5,41.5 27.5,38 27.85,37.65 RLED_R_HIGH.2
PWM1H2
  Bottom 0.4: IC102.10 14.46,31.57 U$9.4
PWM1L1
  Bottom 0.4: IC102.15 21.74,31.5 24,31.5 26.5,34 RLED_R_LOW.2
PWM1L2
  Bottom 0.4: U$9.7 19.27,36.27 18.27,35 18.27,32.75 17.5,32 16.3,32 IC102.11
PWM2H1
  Bottom 0.4: IC102.2 3.5,33.48 U$37.2
PWM2L1
  Bottom 0.4: IC102.3 4.5,33.61 4.5,36 6.15,37.65 RLED_L_LOW.2
RA1
  Bottom 0.4: IC102.20 23.64,27.75 27.75,27.75 28.15,28.15 $$U$108.2
RA4  (via drill 0.4)
  Top 0.4: v14.75,14.75 14.87,14.87 SW2.4
  Bottom 0.4: IC102.34 14.75,16.59 v14.75,14.75
RA9  (via drill 0.4)
  Top 0.4: v13.5,16 13.6,16.09 SW2.3
  Bottom 0.4: IC102.35 13.5,16.48 v13.5,16
RB4  (via drill 0.4)
  Top 0.4: v16.5,15.75 16.13,16.12 SW2.5
  Bottom 0.4: IC102.33 16.7,16 v16.5,15.75
RB7
  Bottom 0.406: IC102.43 9.47,21.5 6.5,21.5 4.75,19.75 4.75,11.5 8.35,7.4 IC100.8
RB8  (via drill 0.4)
  Top 0.4: v8.5,23.25 11,23.25 12.32,24.82 SW2.15
  Bottom 0.4: IC102.44 9.34,22.5 8.75,22.5 8.5,22.75 v8.5,23.25
RB10
  Bottom 0.4: U$9.2 11.92,31.84 IC102.8
RB11
  Bottom 0.4: U$9.3 13.19,35 13.19,31.75 IC102.9
RC8  (via drill 0.4)
  Top 0.4: v9,30.5 10,31.5 19,31.5 19.54,32.04 U$9.8
  Bottom 0.4: IC102.4 9,30.24 v9,30.5
RC9  (via drill 0.4)
  Top 0.4: v11,29.5 12,30.5 19.5,30.5 21,32 21,35 22.08,36.08 U$9.9
  Bottom 0.4: IC102.5 11,29.37 v11,29.5
TLP_R_LOW
  Top 0.4: U$7.P$1 25.28,49.75 TLP_R_LOW.6 25.25,49.82 25.25,51.25 26.5,52.5 28.25,52.5 29.5,53.75 29.5,56 | RP_R_LOW.1 29,56.75 29.5,56.25 29.5,56 | IC_R_LOW.3 29.45,55.95 29.5,56
VCAP/VDDCORE
  Bottom 0.4: IC102.7 9.48,33.15 U$15.1
VPP
  Top 0.4: $$U$13.4 13.55,10.55
  Top 0.5: 13.55,10.55 17.41,14.4 SW2.6

### Text on the board
tPlace: md 1.0v | dsky | CAN | I2C | IR | VPP | Vdd | GND
_tplace: ON